# Altium schematic sheet [05] POWER.SchDoc
size A
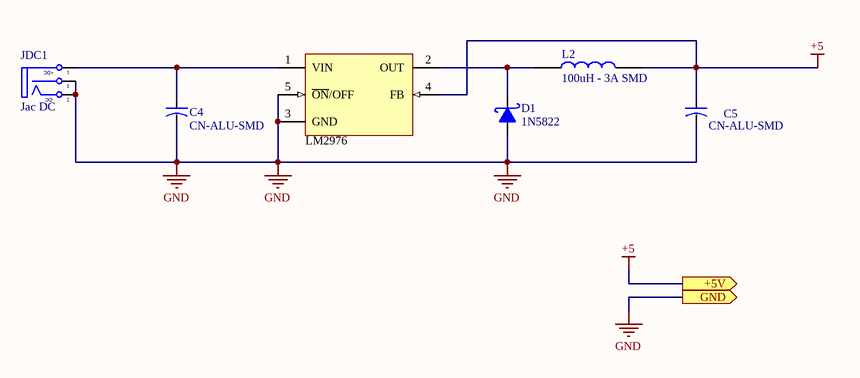
[diagram p0: [05] POWER.SchDoc]

## Parts
C4  CN-ALU-SMD  [CAP-ALU-SMD-F]
C5  CN-ALU-SMD  [CAP-ALU-SMD-F]
D1  1N5822  [DIO-SMD-123]
JDC1  Jac DC  [DC-IN]
L2  100uH - 3A SMD  [Cuon Cam 12x12x10]
U1  LM2976  [TO263]

## Ports
+5V (out), GND (out)

## Nets
+5: C5.1 L2.2 U1.4(FB) ; port +5V
GND: C4.2 C5.2 D1.1(A) JDC1.2(TN) JDC1.3(S) U1.3(GND) U1.5(~{ON}/OFF) ; port GND
NetC4_1: C4.1 JDC1.1(T) U1.1(VIN)
NetD1_2: D1.2(K) L2.1 U1.2(OUT)

## Notes on the sheet
- (in symbol DCIN) +DC; -DC

## Library data of the parts
C4 C5 = CAP-ALU-SMD: Polarized Capacitor (Axial); Published: 8-Jun-2000; LatestRevisionDate: 17-Jul-2002; LatestRevisionNote: Re-released for DXP Platform.; PackageReference: POLAR0.8; Publisher: Altium Limited
D1 = 1N5822: Schottky Rectifiers; Value: Diode c?m 1N5408
JDC1 = DCIN: Jac DC input; Value: Jac DC
L2 = CUON CAM 100uH SMD: Dán; Ma_Hang: MH003999; Don_Vi: Con; Ten_Linh_Kien: Cuộn Cảm 100uH 7x7x4MM CD74; Kieu_Chan: *; Chung_Loai: Dán
U1 = LM2596: Max Input Voltage: 12 V; Max Output Current: 3 (6.0 peak) A; Max Output Voltage: mV; Category: IC-Power; Min Input Voltage: mV; Min Output Voltage: mV; Mounting Technology: Surface Mount; Status: Unreleased; Supply Voltage: mV; Temperature Range: -40 to +125 degC